# EAGLE schematic divchrono-amplifier (EAGLE 7.5.0)
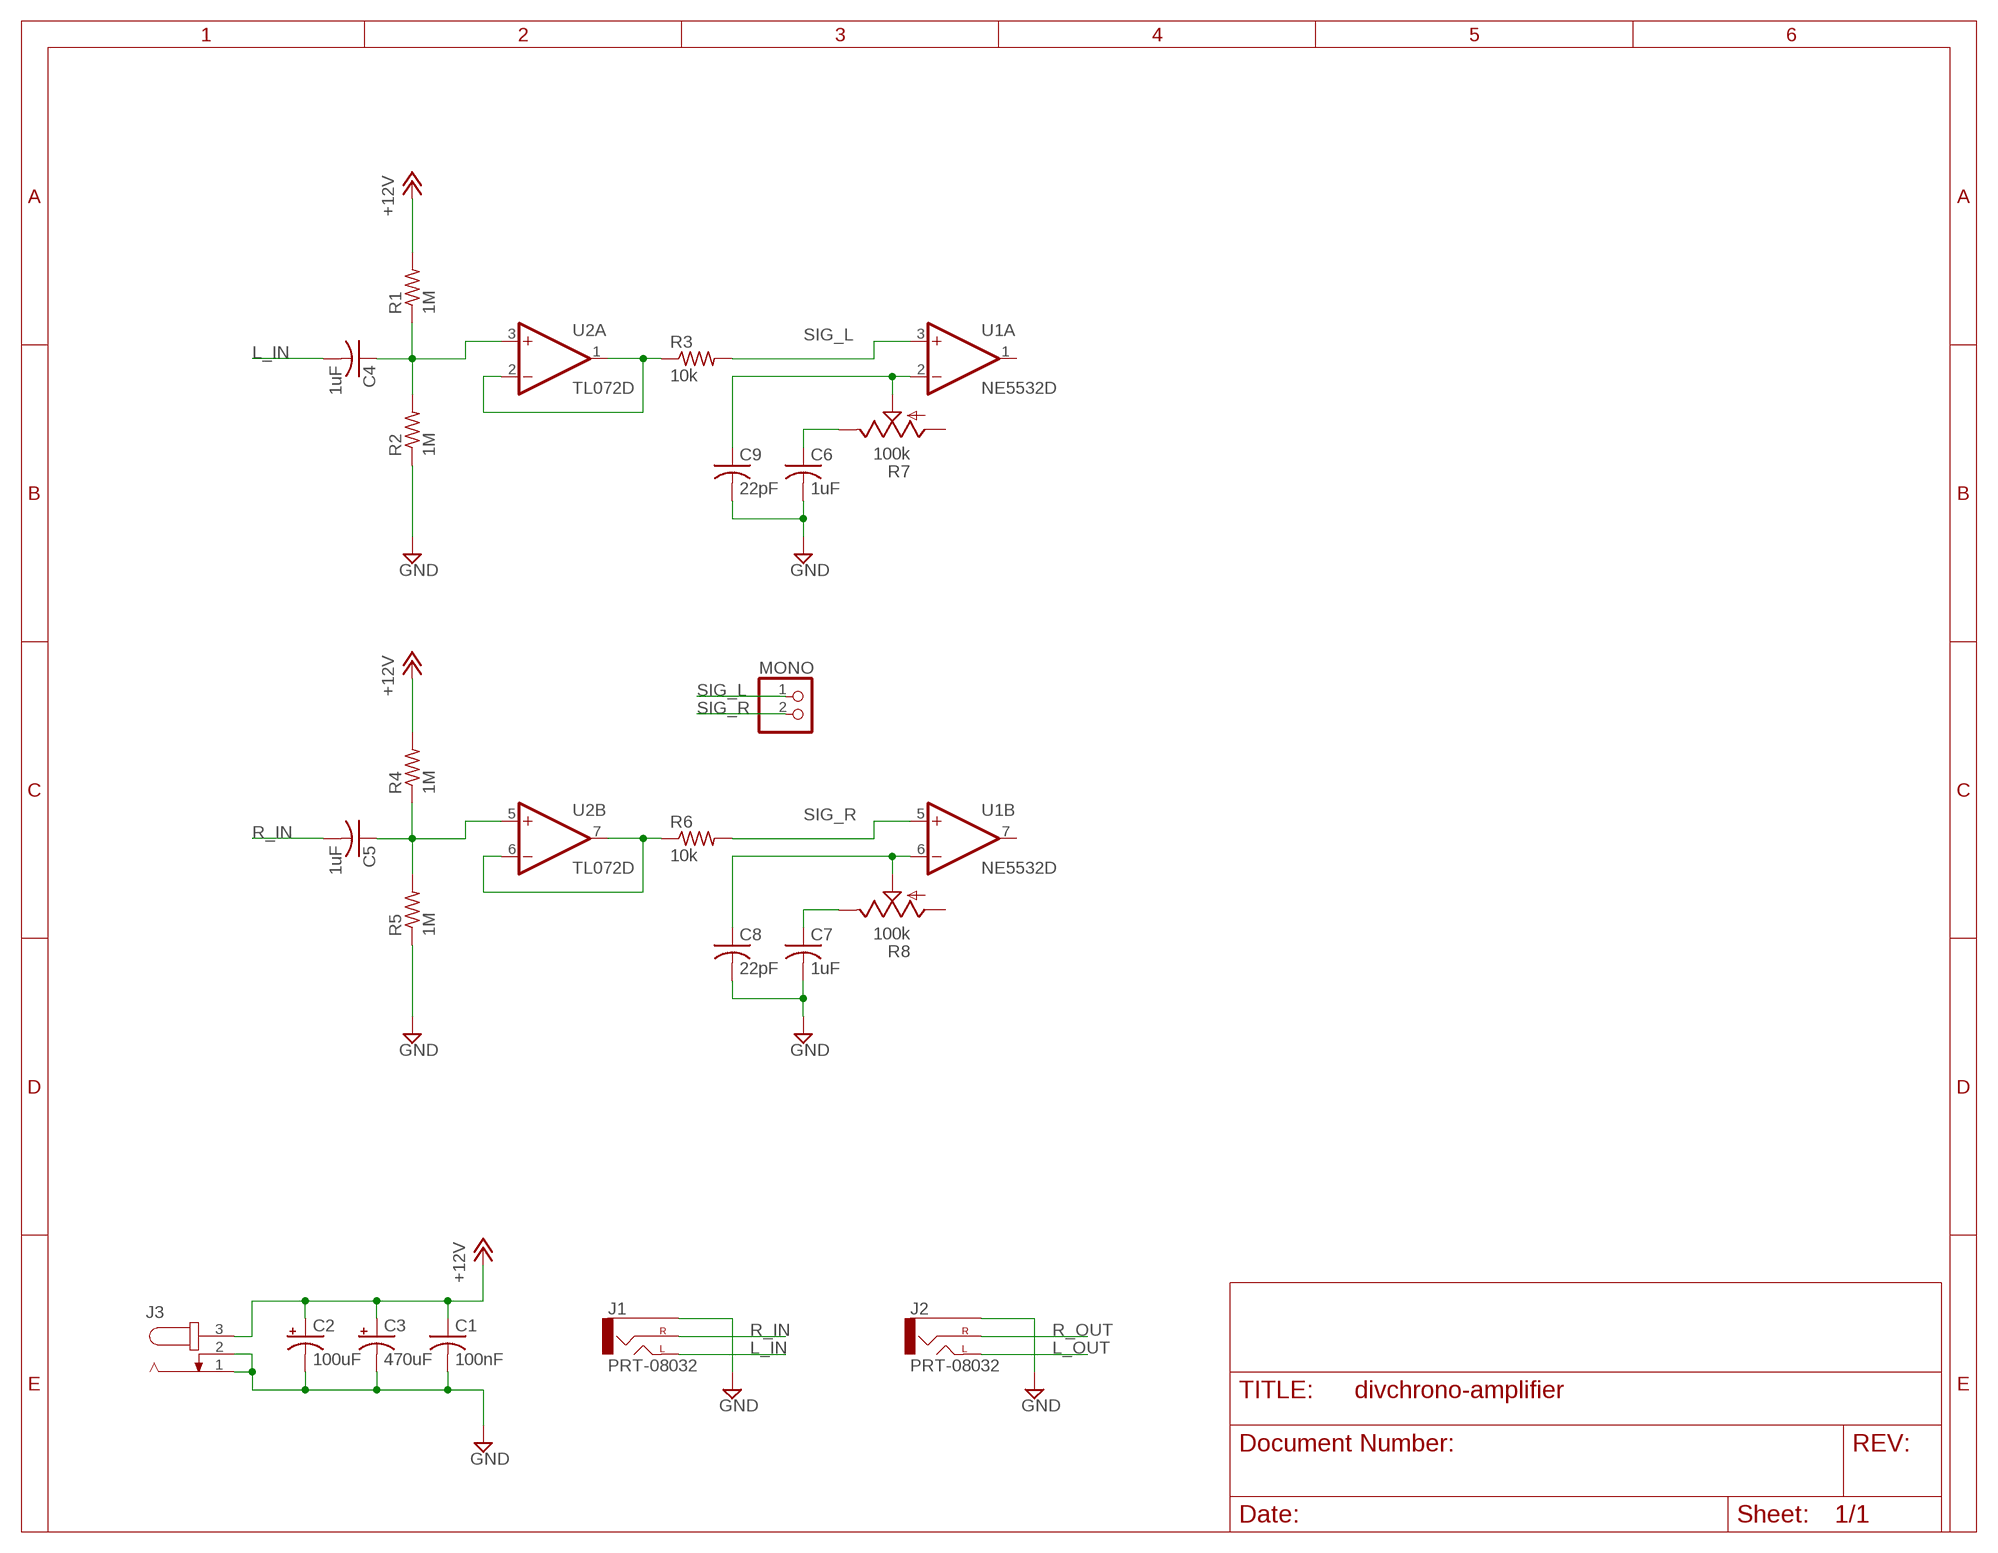
[diagram p0: schematic, sheet 1]

## Parts
C1  100nF  C-USC1206  [C1206]
C2  100uF  CPOL-USE2.5-6  [E2,5-6]
C3  470uF  CPOL-USE2.5-6  [E2,5-6]
C4  1uF  C-USC1206  [C1206]
C5  1uF  C-USC1206  [C1206]
C6  1uF  C-USC1206  [C1206]
C7  1uF  C-USC1206  [C1206]
C8  22pF  C-USC1206  [C1206]
C9  22pF  C-USC1206  [C1206]
J1  PRT-08032  AUDIO-JACKPTH  [AUDIO-JACK]
J2  PRT-08032  AUDIO-JACKPTH  [AUDIO-JACK]
J3  JACK-PLUG0  [SPC4077]
MONO  PINHD-1X2  [1X02]
R1  1M  R-US_R1206  [R1206]
R2  1M  R-US_R1206  [R1206]
R3  10k  R-US_R1206  [R1206]
R4  1M  R-US_R1206  [R1206]
R5  1M  R-US_R1206  [R1206]
R6  10k  R-US_R1206  [R1206]
R7  100k  TRIM_US-CT6  [CT6]
R8  100k  TRIM_US-CT6  [CT6]
U1  NE5532D  [SO08]
U2  TL072D  [SO08]

## Nets
+12V: C1.1 C2.+ C3.+ J3.3 R1.2 R4.2
GND: C1.2 C2.- C3.- C6.2 C7.2 C8.2 C9.2 J1.SLEEVE J2.SLEEVE J3.1 J3.2 R2.1 R5.1
L_IN: C4.2 J1.TIP(LEFT)
L_OUT: J2.TIP(LEFT)
N$1: C4.1 R1.1 R2.2 U2.3(A:+IN)
N$2: R3.1 U2.1(A:OUT) U2.2(A:-IN)
N$4: C5.1 R4.1 R5.2 U2.5(B:+IN)
N$5: R6.1 U2.6(B:-IN) U2.7(B:OUT)
N$7: C9.1 R7.S U1.2(A:-IN)
N$8: C8.1 R8.S U1.6(B:-IN)
N$9: C6.1 R7.E
N$10: C7.1 R8.E
R_IN: C5.2 J1.RING(RIGHT)
R_OUT: J2.RING(RIGHT)
SIG_L: MONO.1 R3.2 U1.3(A:+IN)
SIG_R: MONO.2 R6.2 U1.5(B:+IN)
Unconnected: R7.A R8.A U1.1(A:OUT) U1.7(B:OUT)

## Power pins joined to a net without a drawn wire
V+: U1.8(P:V+) U2.8(P:V+)
V-: U1.4(P:V-) U2.4(P:V-)

## Library data of the parts
C1 C4-C9 = rcl:C-US: CAPACITOR, American symbol
C2 C3 = rcl:CPOL-US: POLARIZED CAPACITOR, American symbol
J1 J2 = SparkFun-Connectors:AUDIO-JACK: 3.5mm Audio Jack Simple 3.5mm common PCB mount audio jack. Variant PTH is our storefront SKU PRT-08032
J3 = con-jack:JACK-PLUG: DC POWER JACK Power Jack, DC, Right Angle, Through Hole, Rated 5A at 16VDC, PC Terminals Distributor: Farnell (www.Farnell.de) Drawing: 84N1161.pdf / 84N1162.pdf Manufacturer: SPC Technology (www.spctechnology.com) Type: SPC4077 / SPC 4078; OC_FARNELL: unknown; OC_NEWARK: unknown
MONO = pinhead:PINHD-1X2: PIN HEADER
R1-R6 = rcl:R-US_: RESISTOR, American symbol
R7 R8 = pot:TRIM_US-: POTENTIOMETER
U1 = linear:NE5532: AUDIO AMPLIFIER
U2 = linear:TL072: OP AMP